# EAGLE design ai_breakout_bme2802 (EAGLE 7.1.0)
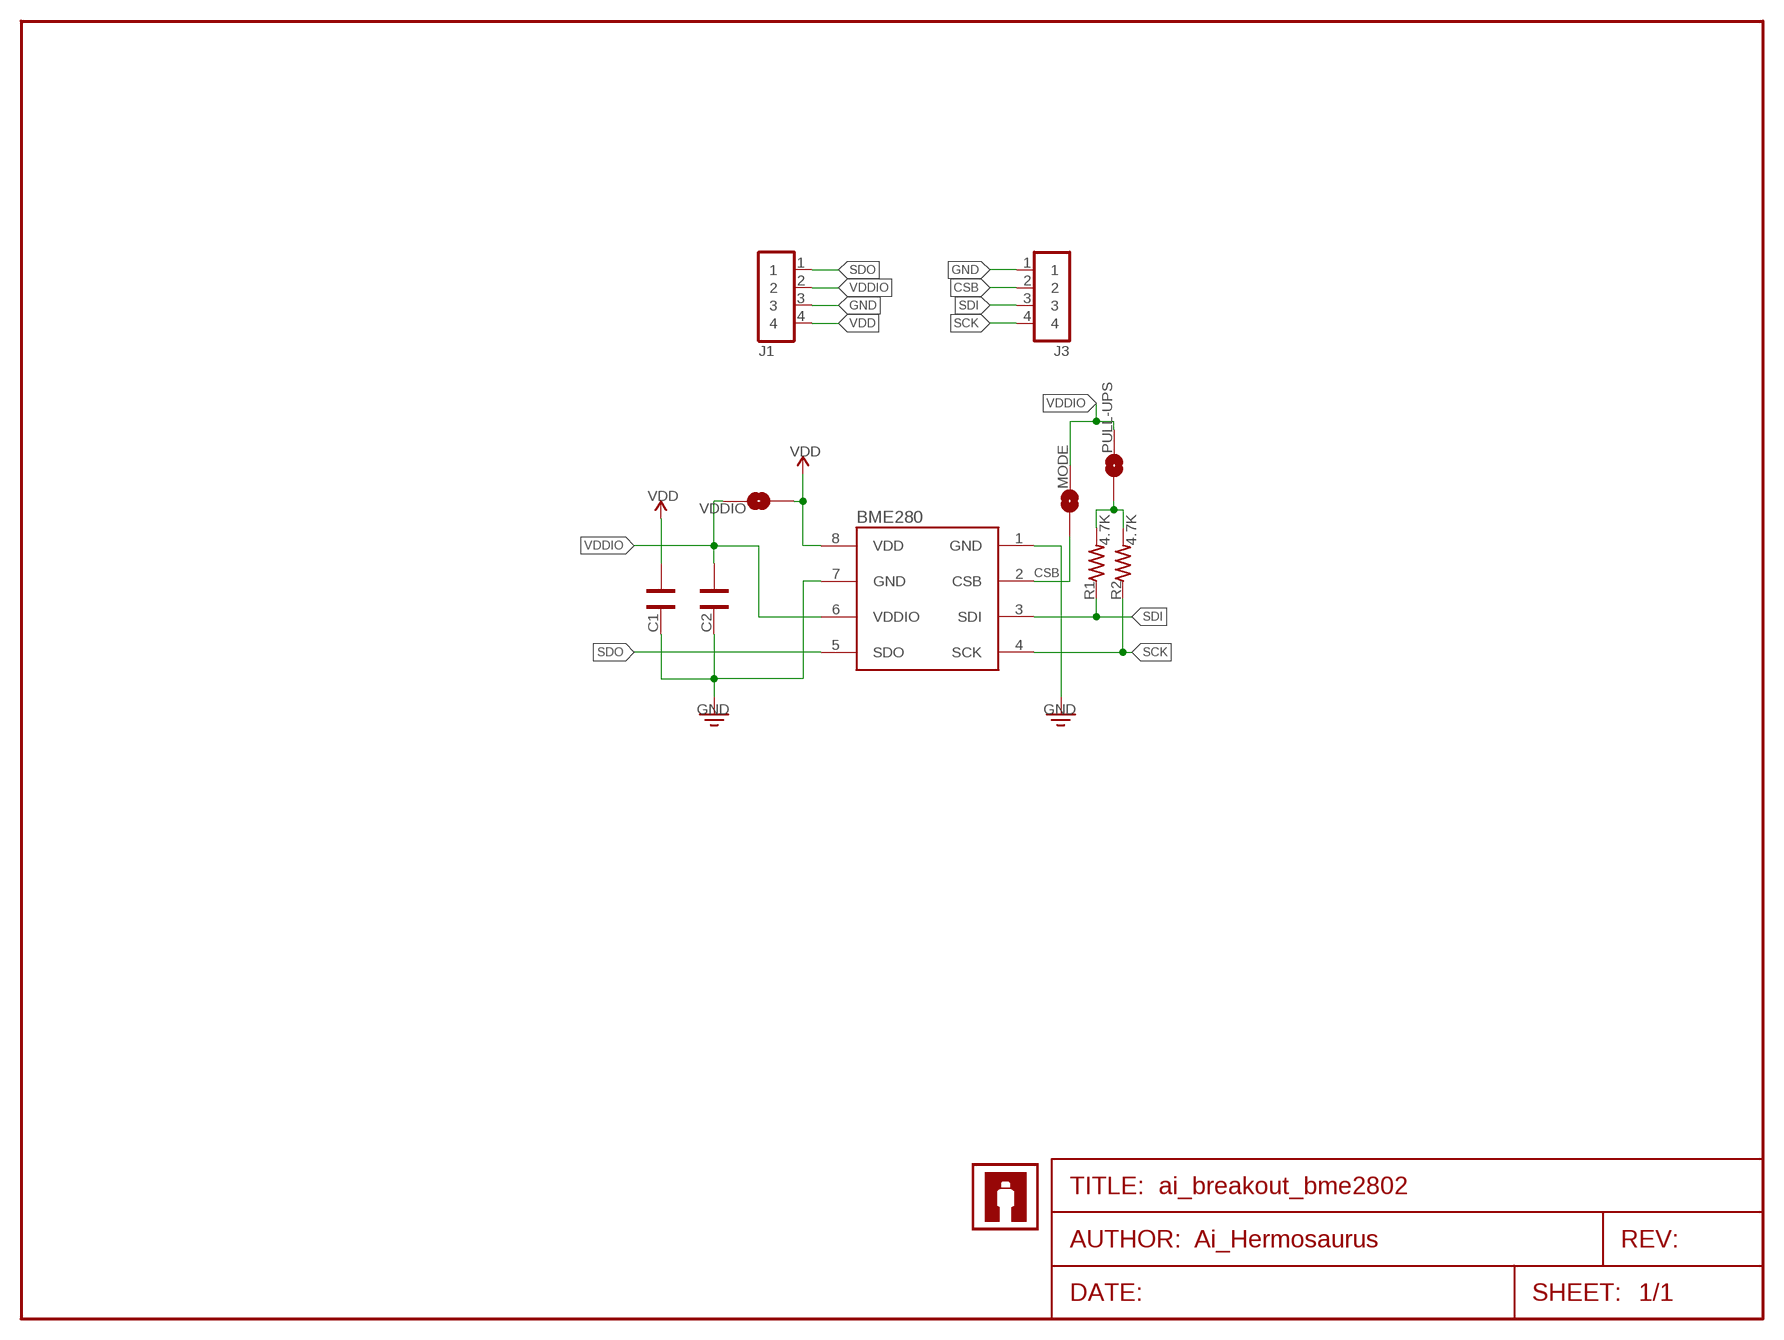
[diagram p0: schematic, sheet 1]

## Parts
C1  CAP0603  [CAP-0603]
C2  CAP0603  [CAP-0603]
J1  1X04NOFIRST  [1X04-NOFIRST]
J3  1X04  [1X04]
MODE  1X02-SJ-NO  [1X02-SJ-NO]
PULL-UPS  1X02-SJ-NO  [1X02-SJ-NO]
R1  4.7K  RES0603  [RES-0603]
R2  4.7K  RES0603  [RES-0603]
U1  BME280  [BME280]
U$2  AI-LOGOXS  [AI-LOGO-XS]
VDDIO  1X02-SJ-NO  [1X02-SJ-NO]

## Nets
CSB: J3.2 MODE.1 U1.2(CSB)
GND: C1.2 C2.2 J1.3 J3.1 U1.1(GND) U1.7(GND)
N$3: PULL-UPS.1 R1.2 R2.2
SCK: J3.4 R2.1 U1.4(SCK)
SDI: J3.3 R1.1 U1.3(SDI)
SDO: J1.1 U1.5(SDO)
VDD: C1.1 J1.4 U1.8(VDD) VDDIO.1
VDDIO: C2.1 J1.2 MODE.2 PULL-UPS.2 U1.6(VDDIO) VDDIO.2

## Notes on the sheet
- Ai_Hermosaurus

## Library data of the parts
C1 C2 = Ai_Passives:CAP
J1 J3 = Ai_Connectors:1X04
MODE PULL-UPS VDDIO = Ai_Connectors:1X02-SJ-NO: A.I. Device 1x02-SJ-* NC has a large amount of paste (see paste layer) so that it should jumper during reflow. Remember that we have a version with a buil-in trace, which needs to be cut in order to have the jumper be NO.
R1 R2 = Ai_Passives:RES: Part # blah Digikey
U1 = Ai_Sensors:BME280
U$2 = Ai_Miscellany:AI-LOGO

## Board
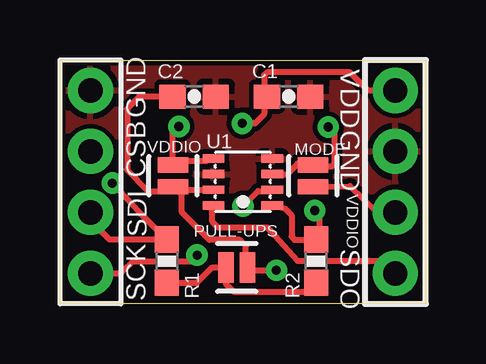
[diagram p1: board, top side]
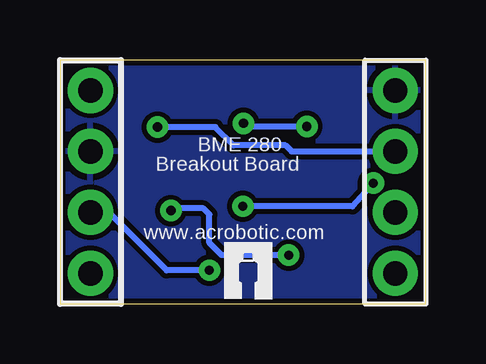
[diagram p2: board, bottom side, seen from below]

Size 15.24 x 10.16 mm. Coordinates in mm from the lower left corner, seen from the top.
Outline: 0,0 0,10.16 15.24,10.16 15.24,0 0,0
Copper layers (1*16): Top 0.035mm / dielectric 1.5mm / Bottom 0.035mm
Design rules "ai_2layer_qfn": minimum track width 7mil, minimum drill 15mil, track to track 8mil, track to pad 8mil, pad to pad 8mil, via to via 8mil, smd to smd 8mil, copper to edge 8mil, drill to drill 8mil, minimum pad ring 1mil, minimum via ring 10mil, stop-mask expansion 4mil, vias tented up to drill 20mil, thermal gap 10mil

### Footprints (pad centres in the part's own frame; a part is rotated, then mirrored left to right if it is on the bottom)
CAP-0603 = smd 1.1 x 1: 1 -0.9,0; 2 0.9,0
1X04-NOFIRST = drill 1.016 pad 1.88: 1 -3.81,0; 2 -1.27,0; 3 1.27,0; 4 3.81,0
1X04 = drill 1.016 pad 1.88: 1 -3.81,0; 2 -1.27,0; 3 1.27,0; 4 3.81,0
1X02-SJ-NO = smd 0.635 x 1.27: 1 -0.45,0; 2 0.45,0
RES-0603 = smd 1.1 x 1: 1 -0.9,0; 2 0.9,0
BME280 = smd 0.9 x 0.35: 1 1.225,0.975; 2 1.225,0.325; 3 1.225,-0.325; 4 1.225,-0.975; 5 -1.225,-0.975; 6 -1.225,-0.325; 7 -1.225,0.325; 8 -1.225,0.975

### Placement (x,y rotation side)
C1  9.53,8.64 0 top
C2  5.59,8.64 0 top
J1  13.97,5.08 90 top
J3  1.27,5.08 270 top
MODE  10.54,5.33 270 top
PULL-UPS  7.37,1.52 0 top
R1  4.45,1.78 270 top
R2  10.67,1.78 270 top
U1  7.62,5.08 0 top
U$2  8.38,0.2 0 bottom
VDDIO  4.7,5.33 270 top

### Tracks (layer width: path | path; a pad name or v marks a point on that pad's centre or on a via)
CSB  (via drill 0.38)
  Top 0.254: U1.2 9.47,5.41 9.91,5.84 10.61,5.84 MODE.1 11.05,5.78 10.92,5.71 11.3,5.71 11.43,5.84 11.43,7.11 v11.18,7.37
  Bottom 0.254: v11.18,7.37 8.76,7.37 8,6.6 5.84,6.6 5.59,6.35 J3.2
GND
  pour Top: 0,0 0,10.16 15.24,10.16 15.24,0
  pour Bottom: 0,0 0,10.16 15.24,10.16 15.24,0
N$3
  Top 0.254: R1.2 5.7,0.88 6.35,1.52 PULL-UPS.1 6.92,0.83 7.24,0.51 10.3,0.51 R2.2
SCK  (via drill 0.38)
  Top 0.254: U1.4 9.36,3.98 9.65,3.68 9.65,2.81 9.78,2.68 9.78,2.67 R2.1 10.79,2.81 10.79,3.68 v10.62,3.89 | v5.71,2.03 5.46,1.78 3.05,1.78 2.54,1.27 J3.4
  Bottom 0.254: v5.71,2.03 8.51,2.03 9.02,2.54 9.02,3.72 9.27,3.98 10.53,3.98 v10.62,3.89
SDI  (via drill 0.38)
  Top 0.254: v2.18,5.03 3.3,3.81 R1.1 2.07,2.68 1.27,3.48 J3.3 | v7.62,4.06 8.26,4.7 8.77,4.7 U1.3
  Bottom 0.254: v2.18,5.03 3.05,4.06 v7.62,4.06
SDO
  Top 0.254: U1.5 6.35,4.06 6.35,3.43 6.6,3.17 8.64,3.17 8.76,3.05 9.91,1.78 13.46,1.78 J1.1
VDD  (via drill 0.38)
  Top 0.254: U1.8 6.1,5.97 5.21,5.97 5.02,5.78 VDDIO.1 4.7,7.14 v4.95,7.39 | v7.59,7.52 8.13,7.52 8.51,7.9 8.5,8.5 C1.1 8.51,8.65 8.51,9.53 8.64,9.65 12.06,9.65 12.83,8.89 J1.4
  Bottom 0.254: v7.59,7.52 7.47,7.39 v4.95,7.39
VDDIO  (via drill 0.38)
  Top 0.254: MODE.2 12.08,4.91 13.21,3.81 J1.2 | C2.1 3.3,8.64 2.79,8.13 2.79,5.59 3.68,4.7 4.63,4.7 VDDIO.2 | PULL-UPS.2 7.82,1.84 | 7.82,1.84 7.75,2.03 7.75,2.41 7.49,2.67 6.22,2.67 5.08,3.81 5.08,4.57 VDDIO.2 | VDDIO.2 4.87,4.76 U1.6 | 7.82,1.84 7.87,1.4 v9.02,1.4
  Bottom 0.254: v9.02,1.4 10.79,1.4 13.21,3.81 J1.2

### Text on the board
tNames: VDD | GND | GND | CSB | VDDIO | SDI | SDO | SCK
bNames: BME 280 | Breakout Board | www.acrobotic.com